# Altium schematic sheet EtherWiz_RiscPC7K.SchDoc
size A3; SheetNumber: 3; SheetTotal: 3
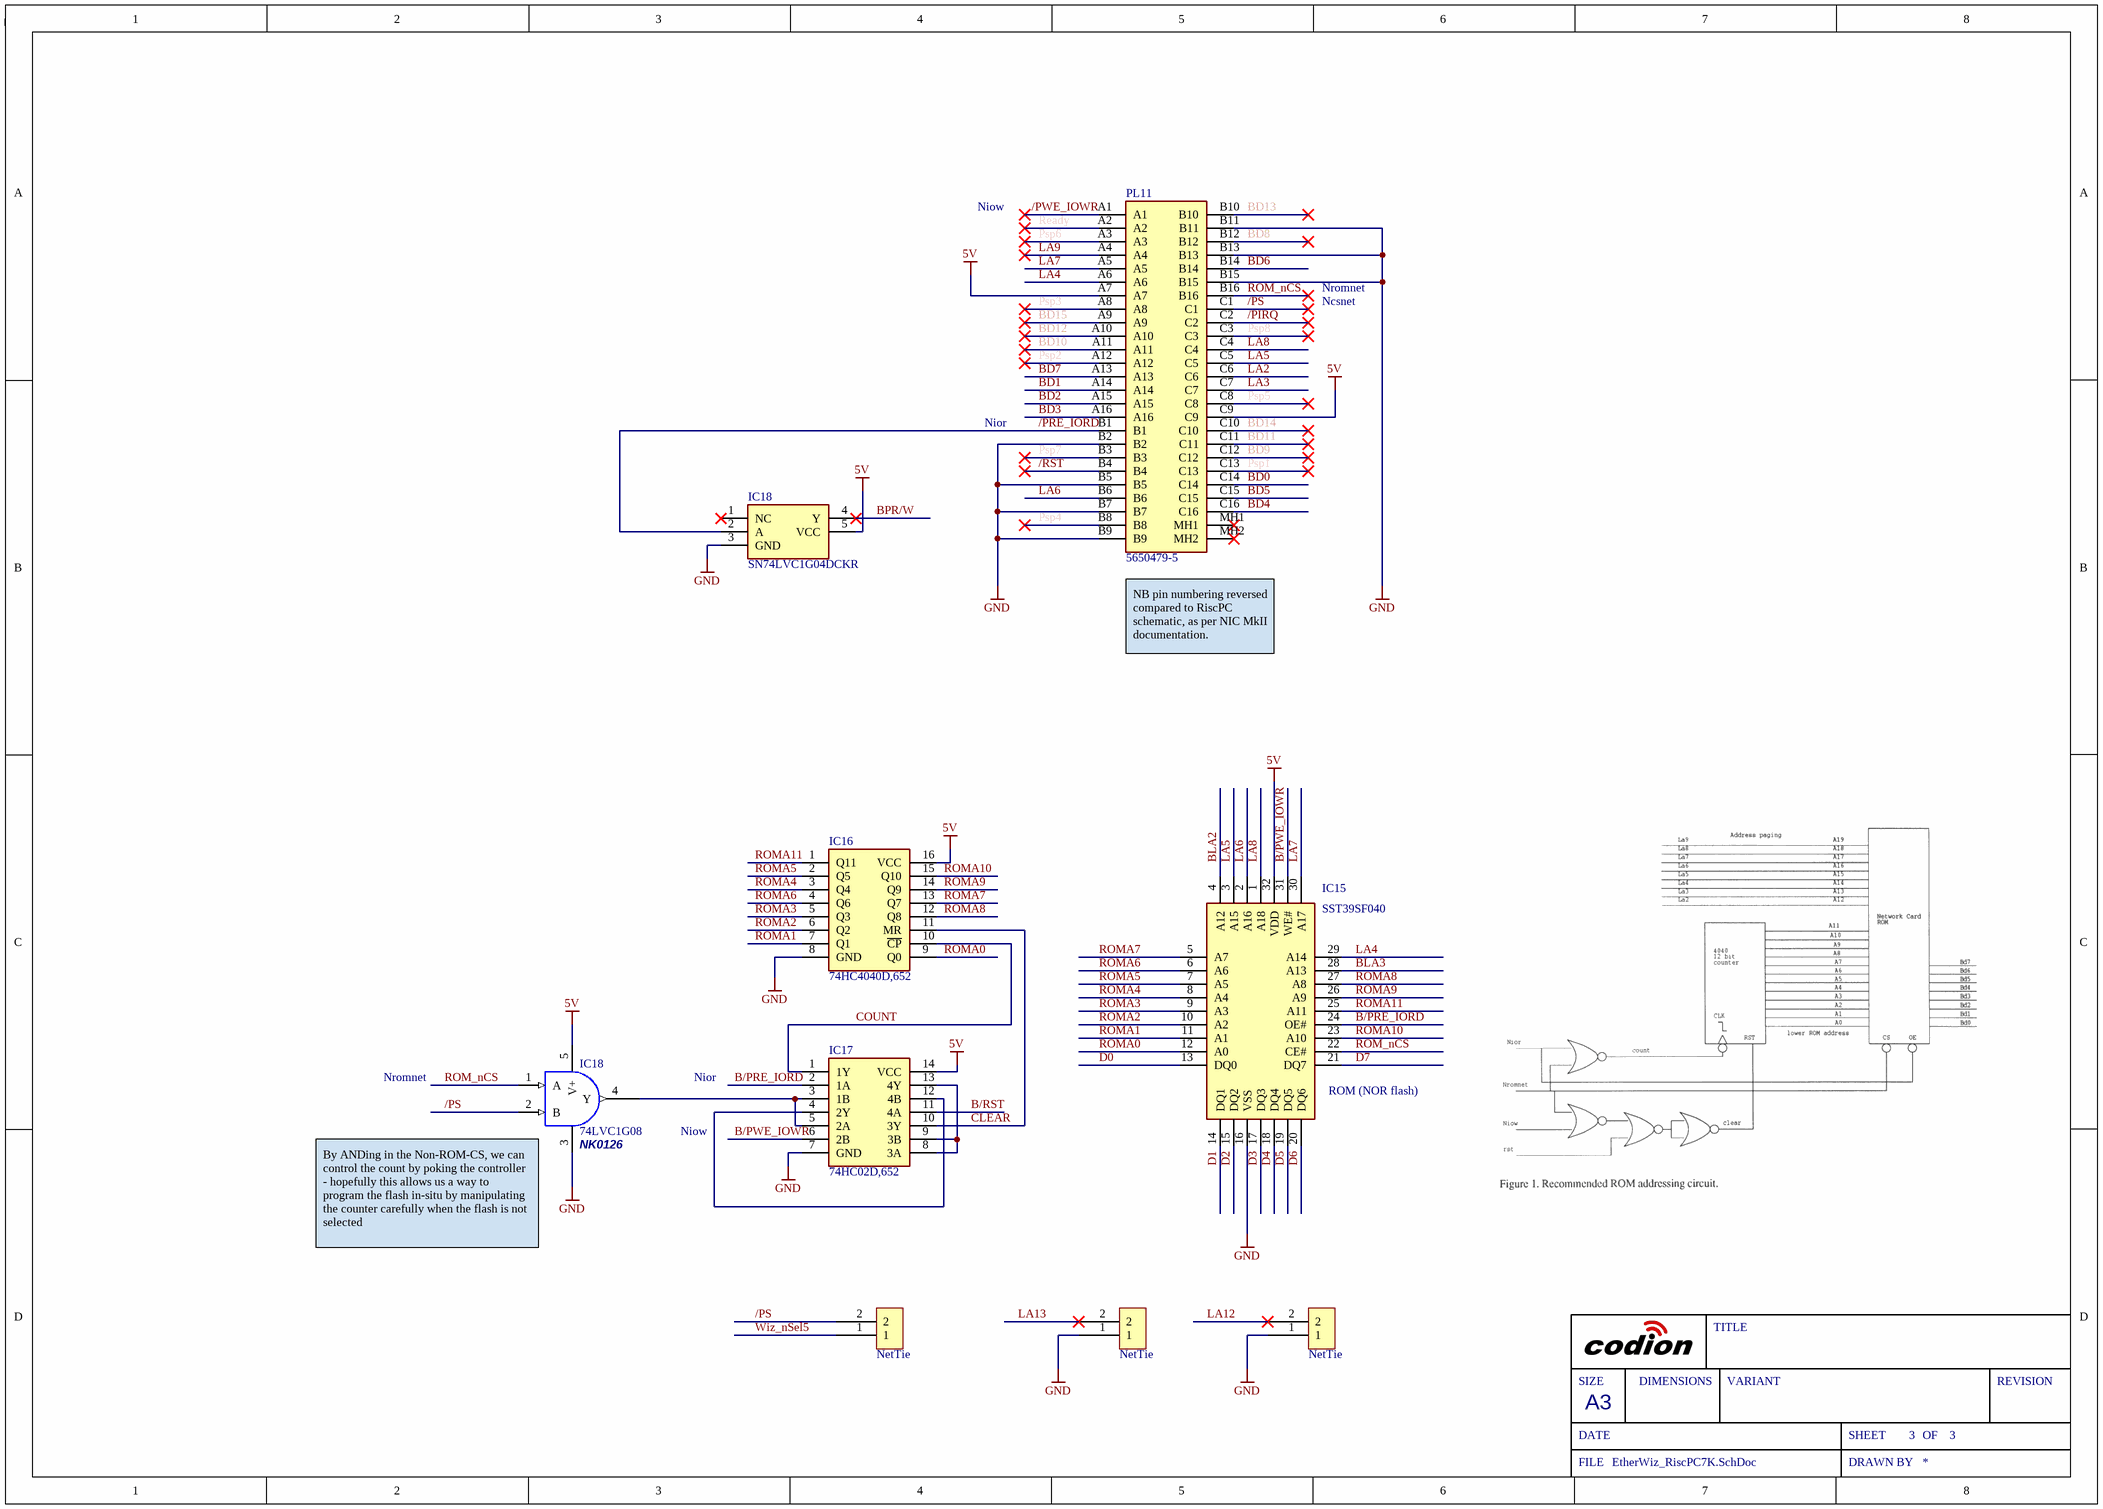
[diagram p0: EtherWiz_RiscPC7K.SchDoc]

## Parts
(Parts that share a designator on the sheet are numbered #1, #2 ... from top to bottom, then left to right.)
*?#1  NetTie  [nettie]  (net tie, no BOM)
*?#2  NetTie  [nettie]  (net tie, no BOM)
*?#3  NetTie  [nettie]  (net tie, no BOM)
IC15  SST39SF040  [PLCC127P1245X1499X356-32N]
IC16  74HC4040D,652  [SOIC127P600X175-16N]
IC17  74HC02D,652  [SOIC127P600X175-14N]
IC18#1  SN74LVC1G04DCKR  [SOT65P210X110-5N]
IC18#2  74LVC1G08  Martel Part No: NK0126  [SOT353]
PL11  5650479-5  [56504795]

## Nets
5V: IC15.32(VDD) IC16.16(VCC) IC17.14(VCC) IC18#1.5(VCC) IC18#2.5(V+) PL11.A7 PL11.C9
GND: *?#2.1 *?#3.1 IC15.16(VSS) IC16.8(GND) IC17.7(GND) IC18#1.3(GND) IC18#2.3(GND) PL11.B2 PL11.B5 PL11.B7 PL11.B9 PL11.B11 PL11.B13 PL11.B15
/PIRQ: PL11.C2
/PRE_IORD: IC18#1.2(A) PL11.B1
/PS: *?#1.2 IC18#2.2(B) PL11.C1
/PWE_IOWR: PL11.A1
/RST: PL11.B4
B/PRE_IORD: IC15.24(OE#) IC17.2(1A)
B/PWE_IOWR: IC15.31(WE#) IC17.6(2B)
B/RST: IC17.11(4A)
BD0: PL11.C14
BD1: PL11.A14
BD2: PL11.A15
BD3: PL11.A16
BD4: PL11.C16
BD5: PL11.C15
BD6: PL11.B14
BD7: PL11.A13
BD8: PL11.B12
BD9: PL11.C12
BD10: PL11.A11
BD11: PL11.C11
BD12: PL11.A10
BD13: PL11.B10
BD14: PL11.C10
BD15: PL11.A9
BLA2: IC15.4(A12)
BLA3: IC15.28(A13)
BPR/W: IC18#1.4(Y)
CLEAR: IC16.11(MR) IC17.10(3Y)
COUNT: IC16.10(~{CP}) IC17.1(1Y)
D0: IC15.13(DQ0)
D1: IC15.14(DQ1)
D2: IC15.15(DQ2)
D3: IC15.17(DQ3)
D4: IC15.18(DQ4)
D5: IC15.19(DQ5)
D6: IC15.20(DQ6)
D7: IC15.21(DQ7)
LA2: PL11.C6
LA3: PL11.C7
LA4: IC15.29(A14) PL11.A6
LA5: IC15.3(A15) PL11.C5
LA6: IC15.2(A16) PL11.B6
LA7: IC15.30(A17) PL11.A5
LA8: IC15.1(A18) PL11.C4
LA9: PL11.A4
LA12: *?#3.2
LA13: *?#2.2
Psp1: PL11.C13
Psp2: PL11.A12
Psp3: PL11.A8
Psp4: PL11.B8
Psp5: PL11.C8
Psp6: PL11.A3
Psp7: PL11.B3
Psp8: PL11.C3
Ready: PL11.A2
ROM_nCS: IC15.22(CE#) IC18#2.1(A) PL11.B16
ROMA0: IC15.12(A0) IC16.9(Q0)
ROMA1: IC15.11(A1) IC16.7(Q1)
ROMA2: IC15.10(A2) IC16.6(Q2)
ROMA3: IC15.9(A3) IC16.5(Q3)
ROMA4: IC15.8(A4) IC16.3(Q4)
ROMA5: IC15.7(A5) IC16.2(Q5)
ROMA6: IC15.6(A6) IC16.4(Q6)
ROMA7: IC15.5(A7) IC16.13(Q7)
ROMA8: IC15.27(A8) IC16.12(Q8)
ROMA9: IC15.26(A9) IC16.14(Q9)
ROMA10: IC15.23(A10) IC16.15(Q10)
ROMA11: IC15.25(A11) IC16.1(Q11)
Wiz_nSel5: *?#1.1
NetIC17_3: IC17.3(1B) IC17.5(2A) IC18#2.4(Y)
NetIC17_4: IC17.4(2Y) IC17.12(4B)
NetIC17_8: IC17.8(3A) IC17.9(3B) IC17.13(4Y)

Not connected (* = marked no-connect by the designer): IC18#1 1(NC)*; PL11 MH1* MH2*

## Notes on the sheet
- Niow
- Nromnet
- Ncsnet
- Nior
- (near PL11) NB pin numbering reversed compared to RiscPC schematic, as per NIC MkII documentation.
- (near IC15) ROM (NOR flash)
- (near IC18#2) By ANDing in the Non-ROM-CS, we can control the count by poking the controller - hopefully this allows us a way to program the flash in-situ by manipulating the counter carefully when the flash is not selected
- SIZE
- DIMENSIONS
- TITLE
- VARIANT
- REVISION
- DATE
- A3
- SHEET
- OF
- FILE
- DRAWN BY

## Library data of the parts
IC15 = SST39SF040-55-4C-NHE: Integrated Circuit; Manufacturer_Name: Microchip; Datasheet Link: http://www.microchip.com/mymicrochip/filehandler.aspx?ddocname=en551028; Height: 3.556mm; Manufacturer_Part_Number: SST39SF040-55-4C-NHE; Mouser Part Number: 579-39SF0405CNHE; Mouser Price/Stock: https://www.mouser.co.uk/ProductDetail/Microchip-Technology/SST39SF040-55-4C-NHE?qs=Ot24P6tC%2FQ41kj5UP%2FTWpA%3D%3D; Arrow Part Number: SST39SF040-55-4C-NHE; Arrow Price/Stock: https://www.arrow.com/en/products/sst39sf040-55-4c-nhe/microchip-technology
IC16 = 74HC4040D,652: Integrated Circuit; Manufacturer_Name: Nexperia; Datasheet Link: https://assets.nexperia.com/documents/data-sheet/74HC_HCT4040.pdf; Height: 1.75mm; Manufacturer_Part_Number: 74HC4040D,652; Mouser Part Number: 771-HC4040D652; Mouser Price/Stock: https://www.mouser.co.uk/ProductDetail/Nexperia/74HC4040D652?qs=P62ublwmbi%252BprP5gU1ILjQ%3D%3D; Arrow Part Number: 74HC4040D,652; Arrow Price/Stock: https://www.arrow.com/en/products/74hc4040d652/nexperia?region=nac
IC17 = 74HC02D,652: Integrated Circuit; Manufacturer_Name: Nexperia; Datasheet Link: https://assets.nexperia.com/documents/data-sheet/74HC_HCT02.pdf; Height: 1.75mm; Manufacturer_Part_Number: 74HC02D,652; Mouser Part Number: 771-74HC02D; Mouser Price/Stock: https://www.mouser.co.uk/ProductDetail/Nexperia/74HC02D652?qs=P62ublwmbi%252BFMRIR72pVEA%3D%3D; Arrow Part Number: 74HC02D,652; Arrow Price/Stock: https://www.arrow.com/en/products/74hc02d652/nexperia?region=europe
IC18#1 = SN74LVC1G04DCKR: Integrated Circuit; Manufacturer_Name: Texas Instruments; Datasheet Link: http://www.ti.com/lit/ds/symlink/sn74lvc1g04.pdf; Height: 1.1mm; Manufacturer_Part_Number: SN74LVC1G04DCKR; Mouser Part Number: 595-SN74LVC1G04DCKR; Mouser Price/Stock: https://www.mouser.co.uk/ProductDetail/Texas-Instruments/SN74LVC1G04DCKR?qs=dT9u2OTAaVWNPsQmeXyvkg%3D%3D; Arrow Part Number: SN74LVC1G04DCKR; Arrow Price/Stock: https://www.arrow.com/en/products/sn74lvc1g04dckr/texas-instruments?region=nac
IC18#2 = IC_LOGIC_74LVC1G08_0: IC Gate AND, 1 Channel, SOT-353; Manufacturer1: Diodes Inc; ManuPart1: 74LVC1G08SE-7; ManuPart2: 74LVC1G08GW,125; Value: 74LVC1G08; Distributor1: Farnell; Manufacturer2: Nexperia; Distributor2: Digikey; Distributor1 Part No: 1845211; Distributor2 Part No: 1727-2872-2-ND; ComponentLinknURL: *; ComponentLink1Description: ComponentLinknURL1; ComponentLink1URL: https://www.diodes.com/assets/Datasheets/74LVC1G08.pdf; ComponentLink2Description: ComponentLinknURL2; ComponentLink2URL: https://assets.nexperia.com/documents/data-sheet/74LVC1G08.pdf
PL11 = 5650479-5: Connector; Manufacturer_Name: TE Connectivity; Datasheet Link: https://www.te.com/commerce/DocumentDelivery/DDEController?Action=showdoc&DocId=Customer+Drawing%7F5650479%7FP%7Fpdf%7FEnglish%7FENG_CD_5650479_P.pdf%7F5650479-5; Height: 11.61mm; Manufacturer_Part_Number: 5650479-5; Mouser Part Number: 571-5650479-5; Mouser Price/Stock: https://www.mouser.co.uk/ProductDetail/TE-Connectivity/5650479-5?qs=xrnNvQC1SKQu%252BZBLSdOcFw%3D%3D; Arrow Part Number: 5650479-5; Arrow Price/Stock: https://www.arrow.com/en/products/5650479-5/te-connectivity?region=europe